# Altium schematic sheet LCboardRev3.SchDoc
size Letter
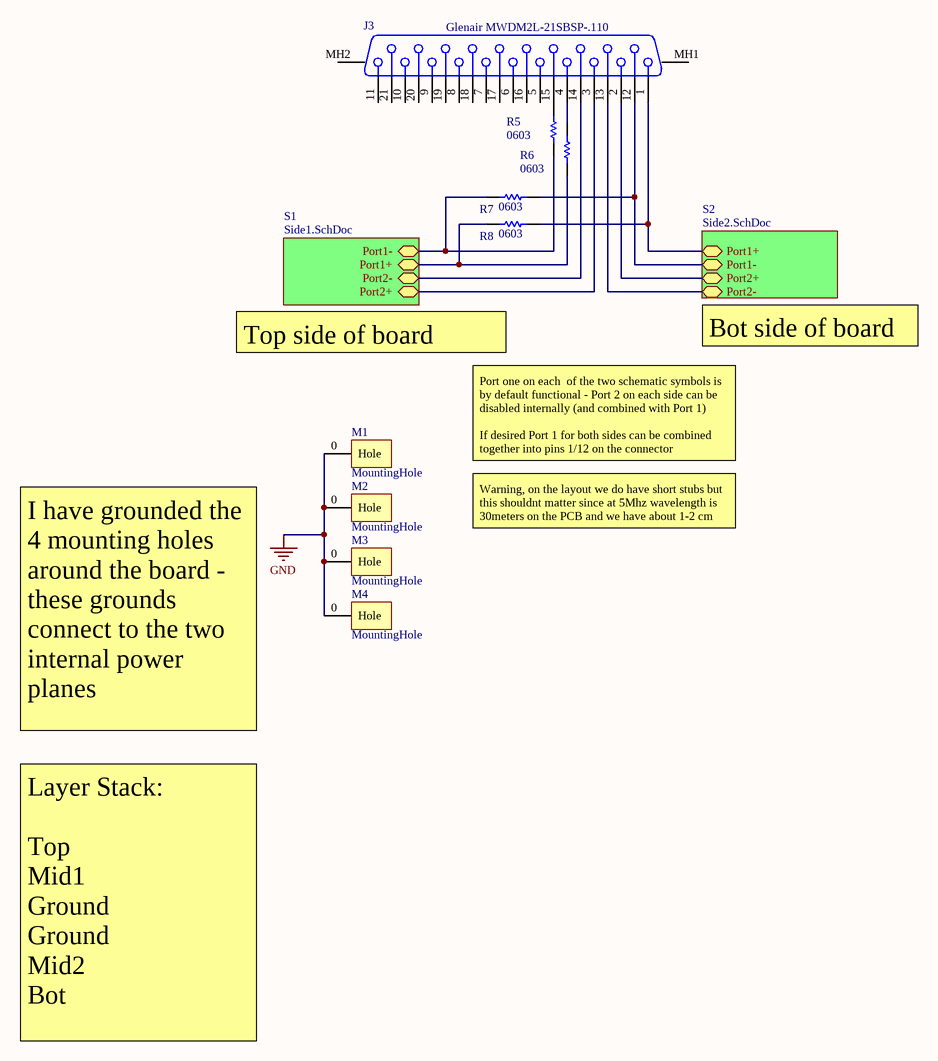
[diagram p0: LCboardRev3.SchDoc]

## Parts
J3  Glenair MWDM2L-21SBSP-.110  [MicroD21Glenair-Vert2row]
M1  MountingHole  [MountingHole]
M2  MountingHole  [MountingHole]
M3  MountingHole  [MountingHole]
M4  MountingHole  [MountingHole]
R5  0603  [0603]
R6  0603  [0603]
R7  0603  [0603]
R8  0603  [0603]

## Sub-sheets
S1 = Side1.SchDoc: Port1+, Port1-, Port2+, Port2-
S2 = Side2.SchDoc: Port1+, Port1-, Port2+, Port2-

## Nets
GND: M1.0(Hole) M2.0(Hole) M3.0(Hole) M4.0(Hole)
NetJ3_1: J3.1 R8.2 ; sheet S2/Port1+
NetJ3_2: J3.2 ; sheet S2/Port2+
NetJ3_3: J3.3 ; sheet S1/Port2+
NetJ3_4: J3.4 R6.2
NetJ3_12: J3.12 R7.2 ; sheet S2/Port1-
NetJ3_13: J3.13 ; sheet S2/Port2-
NetJ3_14: J3.14 ; sheet S1/Port2-
NetJ3_15: J3.15 R5.2
NetR5_1: R5.1 R7.1 ; sheet S1/Port1-
NetR6_1: R6.1 R8.1 ; sheet S1/Port1+

Not connected (* = marked no-connect by the designer): J3 5 6 7 8 9 10 11 16 17 18 19 20 21 MH1 MH2

## Notes on the sheet
- Top side of board
- Bot side of board
- Port one on each  of the two schematic symbols is by default functional - Port 2 on each side can be disabled internally (and combined with Port 1)
  If desired Port 1 for both sides can be combined together into pins 1/12 on the connector
- Warning, on the layout we do have short stubs but this shouldnt matter since at 5Mhz wavelength is 30meters on the PCB and we have about 1-2 cm
- I have grounded the 4 mounting holes around the board - these grounds connect to the two internal power planes
- Layer Stack:
  Top
  Mid1
  Ground
  Ground
  Mid2
  Bot

## Library data of the parts
J3 = GlenairMicroDsub21 -2 row
R5-R8 = Res0603: RES 1 OHM 1/10W 1% 0603 SMD; Value: 1; TechInfo: *